# Altium schematic sheet Sensor_Glove_Sensors-X02.SchDoc: DB_Sensors-X02
size Letter; Organization: Georiga Tech; Address1: North Ave NW; Address3: Atlanta, GA; Address4: USA 30332; DocumentNumber: 1; Revision: X02; SheetNumber: 3; SheetTotal: 4
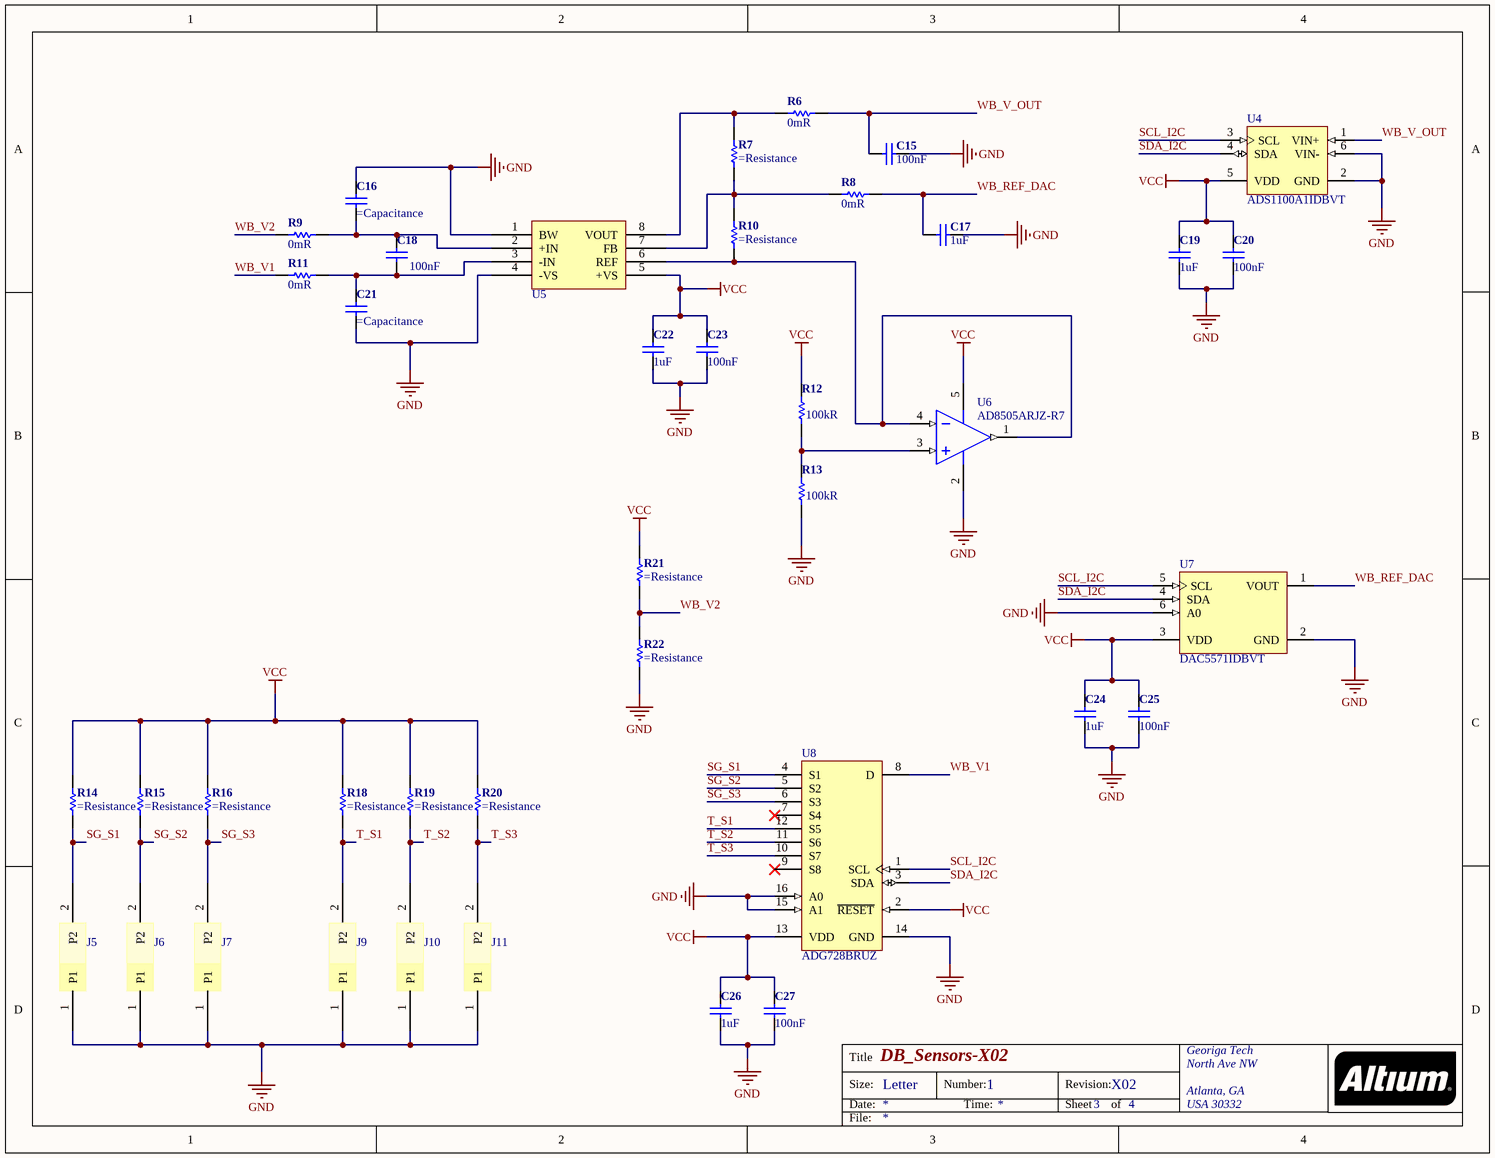
[diagram p0: Sensor_Glove_Sensors-X02.SchDoc]

## Parts
C15  100nF  [C0402]
C16  (no value)  [C0402]
C17  1uF  [C0402]
C18  100nF  [C0402]
C19  1uF  [C0402]
C20  100nF  [C0402]
C21  (no value)  [C0402]
C22  1uF  [C0402]
C23  100nF  [C0402]
C24  1uF  [C0402]
C25  100nF  [C0402]
C26  1uF  [C0402]
C27  100nF  [C0402]
J5  Sensor Interconnect Pads  [Sensor_Interconnect_Pad]  (value not drawn)
J6  Sensor Interconnect Pads  [Sensor_Interconnect_Pad]  (value not drawn)
J7  Sensor Interconnect Pads  [Sensor_Interconnect_Pad]  (value not drawn)
J9  Sensor Interconnect Pads  [Sensor_Interconnect_Pad]  (value not drawn)
J10  Sensor Interconnect Pads  [Sensor_Interconnect_Pad]  (value not drawn)
J11  Sensor Interconnect Pads  [Sensor_Interconnect_Pad]  (value not drawn)
R6  0mR  [R0402]
R7  (no value)  [R0402]
R8  0mR  [R0402]
R9  0mR  [R0402]
R10  (no value)  [R0402]
R11  0mR  [R0402]
R12  100kR  [R0402]
R13  100kR  [R0402]
R14  (no value)  [R0402]
R15  (no value)  [R0402]
R16  (no value)  [R0402]
R18  (no value)  [R0402]
R19  (no value)  [R0402]
R20  (no value)  [R0402]
R21  (no value)  [R0402]
R22  (no value)  [R0402]
U4  ADS1100A1IDBVT  [TI-DBV6_N]
U5  Instrumentation Amplifier  [8-MSOP]  (value not drawn)
U6  AD8505ARJZ-R7  [ADI-RJ-5_N]
U7  DAC5571IDBVT  [TI-DBV6_M]
U8  ADG728BRUZ  [ADI-RU-16_M]

## Nets
GND: C15.2 C16.1 C17.2 C19.2 C20.2 C21.2 C22.2 C23.2 C24.2 C25.2 C26.2 C27.2 J5.1(P1) J6.1(P1) J7.1(P1) J9.1(P1) J10.1(P1) J11.1(P1) R13.2 R22.2 U4.2(GND) U4.6(VIN-) U5.1(BW) U5.4(-VS) U6.2(-V) U7.2(GND) U7.6(A0) U8.14(GND) U8.15(A1) U8.16(A0)
VCC: C19.1 C20.1 C22.1 C23.1 C24.1 C25.1 C26.1 C27.1 R12.1 R14.1 R15.1 R16.1 R18.1 R19.1 R20.1 R21.1 U4.5(VDD) U5.5(+VS) U6.5(+V) U7.3(VDD) U8.2(~{RESET}) U8.13(VDD)
SCL_I2C: U4.3(SCL) U7.5(SCL) U8.1(SCL)
SDA_I2C: U4.4(SDA) U7.4(SDA) U8.3(SDA)
SG_S1: J5.2(P2) R14.2 U8.4(S1)
SG_S2: J6.2(P2) R15.2 U8.5(S2)
SG_S3: J7.2(P2) R16.2 U8.6(S3)
T_S1: J9.2(P2) R18.2 U8.12(S5)
T_S2: J10.2(P2) R19.2 U8.11(S6)
T_S3: J11.2(P2) R20.2 U8.10(S7)
WB_REF_DAC: C17.1 R8.2 U7.1(VOUT)
WB_V1: R11.1 U8.8(D)
WB_V2: R9.1 R21.2 R22.1
WB_V_OUT: C15.1 R6.2 U4.1(VIN+)
NetC16_2: C16.2 C18.1 R9.2 U5.2(+IN)
NetC18_2: C18.2 C21.1 R11.2 U5.3(-IN)
NetR6_1: R6.1 R7.2 U5.8(VOUT)
NetR7_1: R7.1 R8.1 R10.2 U5.7(FB)
NetR10_1: R10.1 U5.6(REF) U6.1(OUT) U6.4(-IN)
NetR12_2: R12.2 R13.1 U6.3(+IN)

Not connected (* = marked no-connect by the designer): U8 7(S4)* 9(S8)*

## Notes on the sheet
- Title
- Size:
- Date:
- Letter
- Number:
- Time:
- Revision:
- Sheet
- of
- File:

## Library data of the parts
C15 C18 C20 C23 C25 C27 = C-0402(1005): Ceramic Capacitor, Multilayer, Ceramic, 25V, 10% +Tol, 10% -Tol, X5R, 15% TC, 0.1uF, Surface Mount, 0402; Manufacturer: Taiyo Yuden; Manufacturer Part Number: TMK105BJ104KV-F; ComponentLink1URL: https://datasheet.ciiva.com/169/product-169683.pdf; ComponentLink1Description: https://datasheet.ciiva.com/169/product-169683.pdf; Supplier 1: Digi-Key; Supplier Part Number 1: 587-1456-1-ND; RoHS: Yes; Category: Ceramic Capacitors; Stock 1: 21960903; Pricing 1: 1=0.10000, 10=0.04400, 50=0.02400, 100=0.01960, 500=0.01398, 1000=0.01098, 2500=0.00998, 5000=0.00918 (USD); Mount: Surface Mount; Case/Package: 0402; Number of Pins: 2; Weight: 2.3E-05oz; Case Code (Imperial): 0402; Case Code (Metric): 1005; Min Operating Temperature: -55°C; Max Operating Temperature: 85°C; Capacitance: 100nF; Tolerance: 10%; Packaging: Tape and Reel; Dielectric: X5R; Voltage Rating (DC): 25V; Voltage Rating: 25V; Package Quantity: 1; Termination: SMD/SMT; Resistor Type: Ceramic; Voltage: 25V; Length: 1mm; Height: 0.5mm; Width: 0.5mm; Depth: 0.5mm; Thickness: 0.022inch; REACH SVHC: No SVHC; Lead Free: Lead Free; Halogen Free: Halogen Free; ComponentLink2URL: https://datasheet.ciiva.com:443/pdfs/VipMasterIC/IC/TAIY/TAIY-S-A0009103435/TAIY-S-A0009103038-1.pdf?src-supplier=IHS+Markit; ComponentLink2Description: https://datasheet.ciiva.com:443/pdfs/VipMasterIC/IC/TAIY/TAIY-S-A0009103435/TAIY-S-A0009103038-1.pdf?src-supplier=IHS+Markit; ComponentLink3URL: https://datasheet.ciiva.com/30051/25tmk105bj104kv-f-30051094.pdf?src-supplier=Onlinecomponents.com; ComponentLink3Description: https://datasheet.ciiva.com/30051/25tmk105bj104kv-f-30051094.pdf?src-supplier=Onlinecomponents.com; ComponentLink4URL: https://datasheet.ciiva.com/15922/28tmk105bj104kv-f-15922315.pdf?src-supplier=Onlinecomponents.com; ComponentLink4Description: https://datasheet.ciiva.com/15922/28tmk105bj104kv-f-15922315.pdf?src-supplier=Onlinecomponents.com; ComponentLink5URL: https://datasheet.ciiva.com/131/tmk105bj104kv-f-ss-131420.pdf?src-supplier=Digi-Key; ComponentLink5Description: https://datasheet.ciiva.com/131/tmk105bj104kv-f-ss-131420.pdf?src-supplier=Digi-Key; ComponentLink6URL: https://datasheet.ciiva.com/22768/1693457-22768649.pdf?src-supplier=Farnell; ComponentLink6Description: https://datasheet.ciiva.com/22768/1693457-22768649.pdf?src-supplier=Farnell
C16 C21 = C-0402(1005): ___ OHM ___ mW 0402(1005) SMD; ComponentLink1URL: https://datasheet.ciiva.com/169/product-169683.pdf; ComponentLink1Description: https://datasheet.ciiva.com/169/product-169683.pdf
C17 C19 C22 C24 C26 = C-0402(1005): Ceramic Capacitor, Multilayer, Ceramic, 6.3V, 20% +Tol, 20% -Tol, X5R, 15% TC, 1uF, Surface Mount, 0402; Manufacturer: Yageo; Manufacturer Part Number: CC0402MRX5R5BB105; Dissipation Factor: 10%; ComponentLink1URL: https://datasheet.ciiva.com/169/product-169683.pdf; ComponentLink1Description: https://datasheet.ciiva.com/169/product-169683.pdf; Supplier 1: Digi-Key; Supplier Part Number 1: 311-1441-1-ND; RoHS: Yes; Category: Ceramic Capacitors; Stock 1: 4097; Pricing 1: 1=0.12000, 10=0.08500, 50=0.04860, 100=0.04020, 500=0.02818, 1000=0.02333, 2500=0.02172, 5000=0.01987 (USD); Mount: Surface Mount; Case/Package: 0402; Number of Pins: 2; Case Code (Imperial): 0402; Case Code (Metric): 1005; Min Operating Temperature: -55°C; Max Operating Temperature: 85°C; Capacitance: 1uF; Tolerance: 20%; Voltage Rating: 6.3V; Voltage Rating (DC): 6.3V; Packaging: Tape and Reel; Package Quantity: 1; Dielectric: X5R; Termination: SMD/SMT; Resistor Type: Ceramic; Length: 1mm; Height: 0.5mm; Width: 0.5mm; Thickness: 0.022inch; Depth: 0.5mm; Lead Free: Lead Free; Halogen Free: Halogen Free; ComponentLink2URL: https://datasheet.ciiva.com:443/pdfs/VipMasterIC/IC/YAGO/YAGO-S-A0006851646/YAGO-S-A0006851646-1.pdf?src-supplier=IHS+Markit; ComponentLink2Description: https://datasheet.ciiva.com:443/pdfs/VipMasterIC/IC/YAGO/YAGO-S-A0006851646/YAGO-S-A0006851646-1.pdf?src-supplier=IHS+Markit; ComponentLink3URL: https://datasheet.ciiva.com/176/mlccorderingcode-176806.pdf?src-supplier=Digi-Key; ComponentLink3Description: https://datasheet.ciiva.com/176/mlccorderingcode-176806.pdf?src-supplier=Digi-Key; ComponentLink4URL: https://datasheet.ciiva.com/176/mlccorderingcode-176807.pdf?src-supplier=Digi-Key; ComponentLink4Description: https://datasheet.ciiva.com/176/mlccorderingcode-176807.pdf?src-supplier=Digi-Key; ComponentLink5URL: https://datasheet.ciiva.com/176/mlccorderingcode-176808.pdf?src-supplier=Digi-Key; ComponentLink5Description: https://datasheet.ciiva.com/176/mlccorderingcode-176808.pdf?src-supplier=Digi-Key
J5-J7 J9-J11 = Sensor_Interconnect: Hole Pads for sensor interconnect solder pads
R6 R8 R9 R11 = R-0402(1005): Fixed Resistor, Metal Glaze/thick Film, 0.0625W, 0ohm, Surface Mount, 0402; Manufacturer: Yageo; Manufacturer Part Number: AC0402JR-070RL; Voltage Rating: 50V; Power Rating: 62.5mW; Tolerance: 5%; Temperature Coefficient: 200ppm/°C; Max Power Dissipation: 63mW; Supplier 1: Digi-Key; Supplier Part Number 1: 311-0.0LBCT-ND; RoHS: Yes; Category: Chip SMD Resistors; Stock 1: 1100119; Pricing 1: 1=0.10000, 10=0.01900, 25=0.01400, 50=0.01080, 100=0.00790, 250=0.00604, 500=0.00482, 1000=0.00355, 5000=0.00255 (USD); Case/Package: 0402; Case Code (Imperial): 0402; Case Code (Metric): 1005; Min Operating Temperature: -55°C; Max Operating Temperature: 155°C; Resistance: 0mR; Packaging: Tape and Reel; Package Quantity: 1; Resistor Type: Thick Film; Termination: SMD/SMT; Number of Terminations: 2; Features: Moisture Resistant,Automotive AEC-Q200,Anti-Sulfur; Length: 0.039inch; Height: 0.015inch; Width: 0.02inch; Lead Free: Lead Free; ComponentLink1URL: https://datasheet.ciiva.com:443/pdfs/VipMasterIC/IC/YAGO/YAGO-S-A0003597364/YAGO-S-A0003597364-1.pdf?src-supplier=IHS+Markit; ComponentLink1Description: https://datasheet.ciiva.com:443/pdfs/VipMasterIC/IC/YAGO/YAGO-S-A0003597364/YAGO-S-A0003597364-1.pdf?src-supplier=IHS+Markit; ComponentLink2URL: http://www.mouser.com/ds/2/447/yageodocoutput-1111992.pdf?src-supplier=Mouser; ComponentLink2Description: http://www.mouser.com/ds/2/447/yageodocoutput-1111992.pdf?src-supplier=Mouser; ComponentLink3URL: http://www.yageo.com/NewPortal/yageodocoutput?fileName=/pdf/R-Chip/PYu-AC_51_RoHS_L_6.pdf&src-supplier=Digi-Key; ComponentLink3Description: http://www.yageo.com/NewPortal/yageodocoutput?fileName=/pdf/R-Chip/PYu-AC_51_RoHS_L_6.pdf&src-supplier=Digi-Key; ComponentLink4URL: http://www.yageo.com/documents/recent/PYu-AC_51_RoHS_L_2_revised.pdf?src-supplier=Future+Electronics; ComponentLink4Description: http://www.yageo.com/documents/recent/PYu-AC_51_RoHS_L_2_revised.pdf?src-supplier=Future+Electronics
R7 R10 R14-R16 R18-R22 = R-0402(1005): ___ OHM ___ mW 0402(1005) SMD
R12 R13 = R-0402(1005): Fixed Resistor, Metal Glaze/thick Film, 0.0625W, 100000ohm, 50V, 1% +/-Tol, 100ppm/Cel, Surface Mount, 0402; Manufacturer: Yageo; Manufacturer Part Number: AC0402FR-07100KL; Power Rating: 62.5mW; Max Power Dissipation: 63mW; Temperature Coefficient: 100ppm/°C; Supplier 1: Digi-Key; Supplier Part Number 1: YAG3434CT-ND; RoHS: Yes; Category: Chip SMD Resistors; Stock 1: 239006; Pricing 1: 1=0.10000, 10=0.02000, 100=0.00830, 1000=0.00374, 2500=0.00324, 5000=0.00268 (USD); Case/Package: 0402; Case Code (Imperial): 0402; Case Code (Metric): 1005; Min Operating Temperature: -55°C; Max Operating Temperature: 155°C; Resistance: 100kR; Tolerance: 1%; Packaging: Tape and Reel; Voltage Rating: 50V; Resistor Type: Thick Film; Number of Terminations: 2; Termination: SMD/SMT; Features: Moisture Resistant,Automotive AEC-Q200; Length: 1mm; Height: 0.015inch; Width: 0.02inch; Depth: 0.5mm; Military Standard: Not; Lead Free: Lead Free; ComponentLink1URL: https://datasheet.ciiva.com:443/pdfs/VipMasterIC/IC/YAGO/YAGO-S-A0003597364/YAGO-S-A0003597364-1.pdf?src-supplier=IHS+Markit; ComponentLink1Description: https://datasheet.ciiva.com:443/pdfs/VipMasterIC/IC/YAGO/YAGO-S-A0003597364/YAGO-S-A0003597364-1.pdf?src-supplier=IHS+Markit; ComponentLink2URL: http://components.arrow.com/part/dataview/0323_03348509?src-supplier=Arrow+Europe; ComponentLink2Description: http://components.arrow.com/part/dataview/0323_03348509?src-supplier=Arrow+Europe; ComponentLink3URL: http://www.yageo.com/NewPortal/yageodocoutput?fileName=/pdf/R-Chip/PYu-AC_51_RoHS_L_6.pdf&src-supplier=Digi-Key; ComponentLink3Description: http://www.yageo.com/NewPortal/yageodocoutput?fileName=/pdf/R-Chip/PYu-AC_51_RoHS_L_6.pdf&src-supplier=Digi-Key; ComponentLink4URL: http://www.yageo.com/documents/recent/PYu-AC_51_RoHS_L_2.pdf?src-supplier=Mouser; ComponentLink4Description: http://www.yageo.com/documents/recent/PYu-AC_51_RoHS_L_2.pdf?src-supplier=Mouser; ComponentLink5URL: http://www.yageo.com/documents/recent/PYu-AC_51_RoHS_L_2_revised.pdf?src-supplier=Future+Electronics; ComponentLink5Description: http://www.yageo.com/documents/recent/PYu-AC_51_RoHS_L_2_revised.pdf?src-supplier=Future+Electronics
U4 = CMP-0003-00255-2: Self-Calibrating, 16-Bit ADC, -40 to 85 degC, 6-pin SOT23 (DBV6), Green (RoHS & no Sb/Br); Manufacturer: Texas Instruments; Number of Channels: 1; Max Power Dissipation: 750uW; Interface: I2C; Number of Bits: 16; Sampling Rate: 128S/s; Resolution: 16b; Polarity: Bipolar; Max Supply Voltage (DC): 5.5V; Min Supply Voltage (DC): 2.7V; Supply Type: Single; Nominal Supply Current: 90uA; Operating Supply Voltage: 5V; Differential Nonlinearity: 1LSB; Supplier 1: Digi-Key; Supplier Part Number 1: 296-14298-1-ND; Manufacturer Part Number: ADS1100A1IDBVT; RoHS: Yes; Category: Analog to Digital Converters (ADCs); Stock 1: 376; Pricing 1: 1=5.33000, 10=4.79100, 25=4.52920, 100=3.72410 (USD); Case/Package: SOT-23; Number of Pins: 6; Contact Plating: Gold; Min Operating Temperature: -40°C; Max Operating Temperature: 85°C; Packaging: Tape and Reel; Package Quantity: 250; Number of Inputs: 1; Number of A/D Converters: 1; Number of Converters: 1; Number of Analog Inputs: 1; Conversion Rate: 128S/s; Min Supply Voltage: 2.7V; Max Supply Voltage: 5.5V; Power Dissipation: 750uW; Number of Elements: 1; Length: 2.9mm; Height: 1.15mm; Width: 1.6mm; Radiation Hardening: No; Lead Free: Lead Free; REACH SVHC: No SVHC; ComponentLink1URL: https://www.ti.com:443/lit/ds/symlink/ads1100.pdf?src-supplier=IHS+Markit; ComponentLink1Description: https://www.ti.com:443/lit/ds/symlink/ads1100.pdf?src-supplier=IHS+Markit; ComponentLink2URL: https://datasheet.ciiva.com/7226/70865-7226785.pdf?src-supplier=Newark; ComponentLink2Description: https://datasheet.ciiva.com/7226/70865-7226785.pdf?src-supplier=Newark; ComponentLink3URL: https://datasheet.ciiva.com/26943/getdatasheetpartid-228526-26943613.pdf?src-supplier=Verical; ComponentLink3Description: https://datasheet.ciiva.com/26943/getdatasheetpartid-228526-26943613.pdf?src-supplier=Verical; ComponentLink4URL: https://datasheet.ciiva.com/26797/ads1100a1idbvt-26797549.pdf?src-supplier=IIIC; ComponentLink4Description: https://datasheet.ciiva.com/26797/ads1100a1idbvt-26797549.pdf?src-supplier=IIIC; ComponentLink5URL: https://datasheet.ciiva.com/1261/ads1100-1261111.pdf?src-supplier=Digi-Key; ComponentLink5Description: https://datasheet.ciiva.com/1261/ads1100-1261111.pdf?src-supplier=Digi-Key; ComponentLink6URL: https://datasheet.ciiva.com/3038/sbas239b-3038715.pdf?src-supplier=Avnet; ComponentLink6Description: https://datasheet.ciiva.com/3038/sbas239b-3038715.pdf?src-supplier=Avnet; ComponentLink7URL: https://datasheet.ciiva.com/1261/ads1100-1261110.pdf?src-supplier=Digi-Key; ComponentLink7Description: https://datasheet.ciiva.com/1261/ads1100-1261110.pdf?src-supplier=Digi-Key; ComponentLink8URL: https://datasheet.ciiva.com/26236/sbas239b-26236358.pdf?src-supplier=Avnet+Europe; ComponentLink8Description: https://datasheet.ciiva.com/26236/sbas239b-26236358.pdf?src-supplier=Avnet+Europe; ComponentLink9URL: https://datasheet.ciiva.com/1261/ads1100-1261112.pdf?src-supplier=Digi-Key; ComponentLink9Description: https://datasheet.ciiva.com/1261/ads1100-1261112.pdf?src-supplier=Digi-Key; ComponentLink10URL: https://datasheet.ciiva.com/22696/1882275-22696410.pdf?src-supplier=Element14; ComponentLink10Description: https://datasheet.ciiva.com/22696/1882275-22696410.pdf?src-supplier=Element14; ComponentLink11URL: https://datasheet.ciiva.com/3038/sbas239b-3038716.pdf?src-supplier=Avnet; ComponentLink11Description: https://datasheet.ciiva.com/3038/sbas239b-3038716.pdf?src-supplier=Avnet
U5 = AD8237: Instrumentation Amplifier, 1 Func, 75uV Offset-Max, 0.2MHz Band Width, CMOS, PDSO8; Manufacturer: Analog Devices; Manufacturer Part Number: AD8237ARMZ-R7; Common Mode Rejection Ratio: 106dB; Slew Rate: 0.15V/µs; Number of Channels: 1; Max Supply Voltage: 5.5V; Nominal Supply Current: 115uA; Input Bias Current: 250pA; Min Supply Voltage: 1.8V; Output Current per Channel: 4mA; Voltage Gain: 60dB; Bandwidth: 20kHz; -3db Bandwidth: 200kHz; Supplier 1: Digi-Key; Supplier Part Number 1: AD8237ARMZ-R7CT-ND; RoHS: Yes; Category: Amplifiers - Op Amps, Buffer, Instrumentation; Stock 1: 18084; Pricing 1: 1=2.68000, 10=2.40400, 25=2.27240, 100=1.86850, 250=1.67660, 500=1.61600 (USD); Mount: Surface Mount; Case/Package: MSOP; Number of Pins: 8; Contact Plating: Tin,Matte; Min Operating Temperature: -40°C; Max Operating Temperature: 125°C; Input Offset Voltage (Vos): 75uV; Packaging: Tape and Reel; Package Quantity: 1; Number of Circuits: 1; Operating Supply Current: 115uA; Number of Elements: 1; Lead Free: Contains Lead; ComponentLink1URL: https://datasheet.ciiva.com:443/pdfs/VipMasterIC/IC/ANDI/ANDIS13412/ANDIS13412-1.pdf?src-supplier=IHS+Markit; ComponentLink1Description: https://datasheet.ciiva.com:443/pdfs/VipMasterIC/IC/ANDI/ANDIS13412/ANDIS13412-1.pdf?src-supplier=IHS+Markit; ComponentLink2URL: https://datasheet.ciiva.com/6626/ad8237-6626733.pdf?src-supplier=Digi-Key; ComponentLink2Description: https://datasheet.ciiva.com/6626/ad8237-6626733.pdf?src-supplier=Digi-Key; ComponentLink3URL: https://datasheet.ciiva.com/8582/ad8237-8582303.pdf?src-supplier=Avnet; ComponentLink3Description: https://datasheet.ciiva.com/8582/ad8237-8582303.pdf?src-supplier=Avnet
U6 = CMP-0384-01459-1: Single Channel Rail-to-Rail Operational Amplifier, 95 Hz BW, 13 mV/us SR, Industrial, 5-pin SOT23 (RJ-5), Reel; Manufacturer: Analog Devices; Max Supply Voltage: 5V; Common Mode Rejection Ratio: 90dB; Gain Bandwidth Product: 95kHz; Min Supply Voltage: 1.8V; Voltage Gain: 120dB; Min Dual Supply Voltage: 900mV; Max Dual Supply Voltage: 2.5V; Slew Rate: 0.013V/µs; Number of Channels: 1; Input Bias Current: 1pA; Input Offset Voltage (Vos): 2.5mV; Power Supply Rejection Ratio (PSRR): 110dB; Operating Supply Current: 25.5uA; Output Current per Channel: 45mA; Operating Supply Voltage: 3V; Input Capacitance: 4.2pF; Supplier 1: Digi-Key; Supplier Part Number 1: AD8505ARJZ-R7CT-ND; Manufacturer Part Number: AD8505ARJZ-R7; RoHS: Yes; Category: Amplifiers - Op Amps, Buffer, Instrumentation; Stock 1: 2044; Pricing 1: 1=1.55000, 10=1.38700, 25=1.31600, 100=1.01050, 250=0.89300, 500=0.84600, 1000=0.68150 (USD); Case/Package: SOT-23-5; Number of Pins: 5; Contact Plating: Tin,Matte; Min Operating Temperature: -40°C; Max Operating Temperature: 125°C; Packaging: Tape and Reel; Number of Circuits: 1; Package Quantity: 3000; Number of Elements: 1; Unity Gain Bandwidth Product: 95kHz; Number of Amplifiers: 1; Quiescent Current: 25.5uA; Bandwidth: 95kHz; Lead Free: Contains Lead; REACH SVHC: No SVHC; ComponentLink1URL: https://datasheet.ciiva.com:443/pdfs/VipMasterIC/IC/ANDI/ANDI-S-A0003407821/ANDI-S-A0003407815-1.pdf?src-supplier=IHS+Markit; ComponentLink1Description: https://datasheet.ciiva.com:443/pdfs/VipMasterIC/IC/ANDI/ANDI-S-A0003407821/ANDI-S-A0003407815-1.pdf?src-supplier=IHS+Markit; ComponentLink2URL: https://datasheet.ciiva.com/22712/1610834-22712017.pdf?src-supplier=Element14; ComponentLink2Description: https://datasheet.ciiva.com/22712/1610834-22712017.pdf?src-supplier=Element14; ComponentLink3URL: https://datasheet.ciiva.com/11711/ad8505-8506-8508-11711719.pdf?src-supplier=Avnet; ComponentLink3Description: https://datasheet.ciiva.com/11711/ad8505-8506-8508-11711719.pdf?src-supplier=Avnet; ComponentLink4URL: https://datasheet.ciiva.com/1135/1610834-1135532.pdf?src-supplier=Element14; ComponentLink4Description: https://datasheet.ciiva.com/1135/1610834-1135532.pdf?src-supplier=Element14
U7 = CMP-0004-00333-1: Low-Power, 8-Bit DAC with High-Speed I2C Input, -40 to 105 degC, 6-pin SOT23 (DBV6), Green (RoHS & no Sb/Br); Manufacturer: Texas Instruments; Settling Time: 8us; Number of Bits: 8; Operating Supply Voltage: 5V; Resolution: 8b; Sampling Rate: 188KS/s; Output Type: Voltage; Number of Channels: 1; Max Supply Voltage: 5.5V; Min Supply Voltage: 2.7V; Supply Type: Single; Polarity: Unipolar; Integral Nonlinearity (INL): 1LSB; Nominal Supply Current: 155uA; Differential Nonlinearity: 0.25LSB; Power Consumption: 400uW; Supplier 1: Digi-Key; Supplier Part Number 1: 296-17199-1-ND; Manufacturer Part Number: DAC5571IDBVT; RoHS: Yes; Category: Digital to Analog Converters (DACs); Stock 1: 4888; Pricing 1: 1=1.49000, 10=1.34100, 25=1.26520, 100=1.01200 (USD); Case/Package: SOT-23; Number of Pins: 6; Weight: 0.00127oz; Contact Plating: Gold; Min Operating Temperature: -40°C; Max Operating Temperature: 105°C; Packaging: Tape and Reel; Package Quantity: 250; Interface: I2C; Conversion Rate: 188KS/s; Number of DAC Channels: 1; Number of Converters: 1; Operating Supply Current: 155uA; Length: 2.9mm; Height: 1.15mm; Width: 1.6mm; Radiation Hardening: No; Lead Free: Lead Free; REACH SVHC: No SVHC; ComponentLink1URL: https://www.ti.com:443/lit/ds/symlink/dac5571.pdf?src-supplier=IHS+Markit; ComponentLink1Description: https://www.ti.com:443/lit/ds/symlink/dac5571.pdf?src-supplier=IHS+Markit; ComponentLink2URL: https://datasheet.ciiva.com/15146/getdatasheetpartid-184785-15146834.pdf?src-supplier=Verical; ComponentLink2Description: https://datasheet.ciiva.com/15146/getdatasheetpartid-184785-15146834.pdf?src-supplier=Verical; ComponentLink3URL: https://datasheet.ciiva.com/1597/dac5571-1597245.pdf?src-supplier=Newark; ComponentLink3Description: https://datasheet.ciiva.com/1597/dac5571-1597245.pdf?src-supplier=Newark; ComponentLink4URL: https://datasheet.ciiva.com/34302/1337393-34302226.pdf?src-supplier=Jameco; ComponentLink4Description: https://datasheet.ciiva.com/34302/1337393-34302226.pdf?src-supplier=Jameco; ComponentLink5URL: https://datasheet.ciiva.com/4779/slas405a-117423-4779268.pdf?src-supplier=Mouser; ComponentLink5Description: https://datasheet.ciiva.com/4779/slas405a-117423-4779268.pdf?src-supplier=Mouser; ComponentLink6URL: https://datasheet.ciiva.com/41460/001186519-da-01-en-8-bit-12c-single-dac5571idbvt-sot-23-tid-41460679.pdf?src-supplier=Conrad; ComponentLink6Description: https://datasheet.ciiva.com/41460/001186519-da-01-en-8-bit-12c-single-dac5571idbvt-sot-23-tid-41460679.pdf?src-supplier=Conrad; ComponentLink7URL: https://datasheet.ciiva.com/26235/dac5571-26235157.pdf?src-supplier=Avnet+Europe; ComponentLink7Description: https://datasheet.ciiva.com/26235/dac5571-26235157.pdf?src-supplier=Avnet+Europe; ComponentLink8URL: https://datasheet.ciiva.com/1362/dac5571-1362876.pdf?src-supplier=Digi-Key; ComponentLink8Description: https://datasheet.ciiva.com/1362/dac5571-1362876.pdf?src-supplier=Digi-Key; ComponentLink9URL: https://datasheet.ciiva.com/1362/dac5571-1362877.pdf?src-supplier=Digi-Key; ComponentLink9Description: https://datasheet.ciiva.com/1362/dac5571-1362877.pdf?src-supplier=Digi-Key; ComponentLink10URL: https://datasheet.ciiva.com/1362/dac5571-1362878.pdf?src-supplier=Digi-Key; ComponentLink10Description: https://datasheet.ciiva.com/1362/dac5571-1362878.pdf?src-supplier=Digi-Key; ComponentLink11URL: https://datasheet.ciiva.com/3040/dac5571-3040451.pdf?src-supplier=Avnet; ComponentLink11Description: https://datasheet.ciiva.com/3040/dac5571-3040451.pdf?src-supplier=Avnet; ComponentLink12URL: https://datasheet.ciiva.com/3040/dac5571-3040452.pdf?src-supplier=Avnet; ComponentLink12Description: https://datasheet.ciiva.com/3040/dac5571-3040452.pdf?src-supplier=Avnet; ComponentLink13URL: https://datasheet.ciiva.com/46430/1762718-46430597.pdf?src-supplier=Element14; ComponentLink13Description: https://datasheet.ciiva.com/46430/1762718-46430597.pdf?src-supplier=Element14
U8 = CMP-0798-00197-1: CMOS, Low Voltage, 2-Wire Serially Controlled, Matrix Switch, -40 to 85 degC, 16-pin SOP (RU-16), Tube; Manufacturer: Analog Devices; Min Supply Voltage: 2.7V; Max Supply Voltage: 5.5V; On-State Resistance: 4.5R; Throw Configuration: DPST; Number of Circuits: 1; -3db Bandwidth: 65MHz; Max Power Dissipation: 100uW; Number of Inputs: 8; Max Supply Current: 20uA; Interface: Serial,2-Wire; Operating Supply Current: 10uA; Turn-Off Delay Time: 85ns; Turn-On Delay Time: 95ns; High Level Output Current: 120mA; Drain to Source Resistance: 2.5R; Supplier 1: Digi-Key; Supplier Part Number 1: ADG728BRUZ-ND; Manufacturer Part Number: ADG728BRUZ; RoHS: Yes; Category: Decoders and Multiplexers; Stock 1: 1351; Pricing 1: 1=5.54000, 10=4.97400, 25=4.70240, 100=3.86650, 250=3.46940, 500=3.34400, 1000=3.03050 (USD); Case/Package: TSSOP; Number of Pins: 16; Contact Plating: Tin,Matte; Min Operating Temperature: -40°C; Max Operating Temperature: 85°C; Packaging: Rail/Tube; Package Quantity: 96; Number of Channels: 1; Number of Outputs: 1; Bandwidth: 65MHz; Number of Bits: 8; Nominal Supply Current: 20uA; Length: 5mm; Height: 1.05mm; Width: 4.4mm; Radiation Hardening: No; Lead Free: Contains Lead; REACH SVHC: No SVHC; ComponentLink1URL: https://datasheet.ciiva.com:443/pdfs/VipMasterIC/IC/ANDI/ANDIS13257/ANDIS13257-1.pdf?src-supplier=IHS+Markit; ComponentLink1Description: https://datasheet.ciiva.com:443/pdfs/VipMasterIC/IC/ANDI/ANDIS13257/ANDIS13257-1.pdf?src-supplier=IHS+Markit; ComponentLink2URL: https://datasheet.ciiva.com/1171/1610644-1171108.pdf?src-supplier=Element14; ComponentLink2Description: https://datasheet.ciiva.com/1171/1610644-1171108.pdf?src-supplier=Element14; ComponentLink3URL: https://datasheet.ciiva.com/5797/adg728-729-5797207.pdf?src-supplier=Farnell; ComponentLink3Description: https://datasheet.ciiva.com/5797/adg728-729-5797207.pdf?src-supplier=Farnell; ComponentLink4URL: https://datasheet.ciiva.com/1668/adg728-729-1668904.pdf?src-supplier=Digi-Key; ComponentLink4Description: https://datasheet.ciiva.com/1668/adg728-729-1668904.pdf?src-supplier=Digi-Key; ComponentLink5URL: https://datasheet.ciiva.com/2978/adg728-729-2978667.pdf?src-supplier=Avnet; ComponentLink5Description: https://datasheet.ciiva.com/2978/adg728-729-2978667.pdf?src-supplier=Avnet; ComponentLink6URL: https://datasheet.ciiva.com/7986/adg728-729-7986413.pdf?src-supplier=Element14; ComponentLink6Description: https://datasheet.ciiva.com/7986/adg728-729-7986413.pdf?src-supplier=Element14; ComponentLink7URL: https://datasheet.ciiva.com/48708/001248036-da-01-en-ic-mux-demux-8x1-adg728bruz-tssop-16-adi-48708636.pdf?src-supplier=Conrad; ComponentLink7Description: https://datasheet.ciiva.com/48708/001248036-da-01-en-ic-mux-demux-8x1-adg728bruz-tssop-16-adi-48708636.pdf?src-supplier=Conrad